# EAGLE design HDR camera controller (EAGLE 9.6.2)
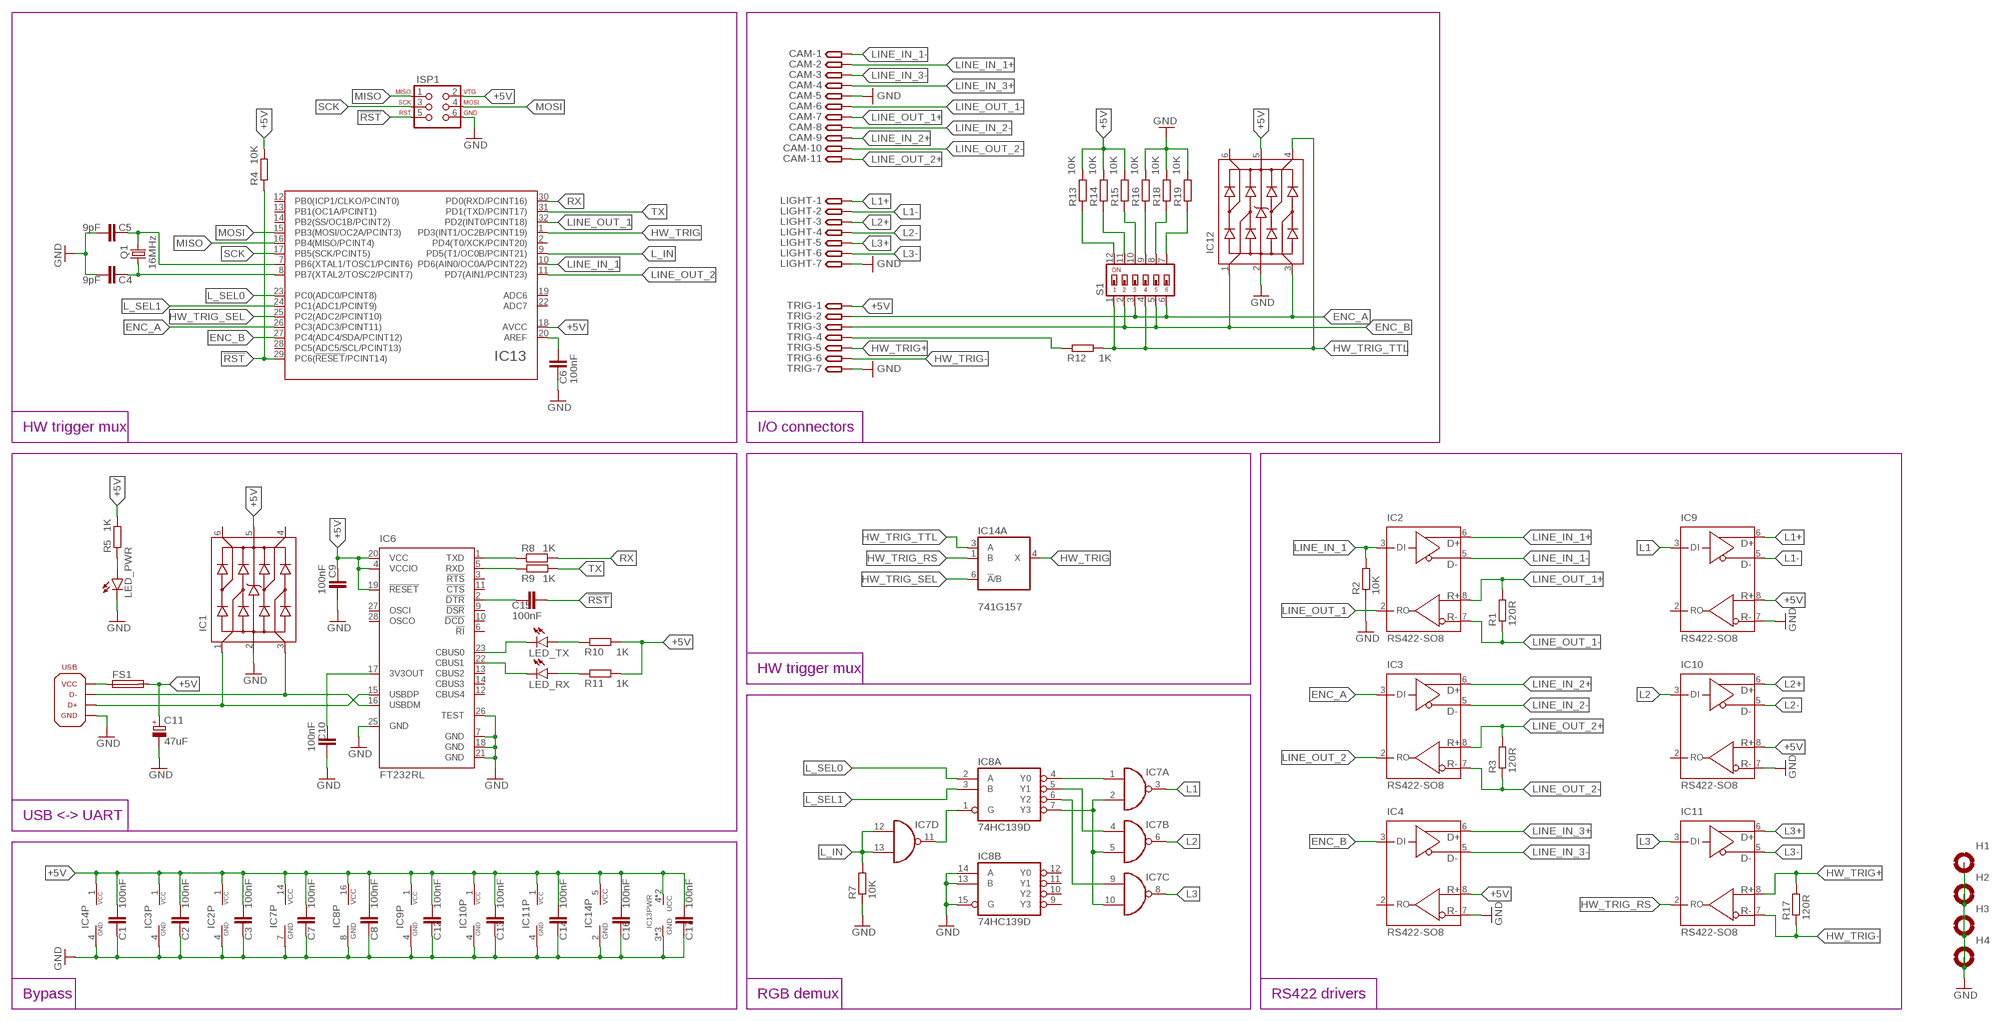
[diagram p0: schematic, sheet 1]

## Parts
C1  100nF  C-EUC0805  [C0805]
C2  100nF  C-EUC0805  [C0805]
C3  100nF  C-EUC0805  [C0805]
C4  9pF  C-EUC0805  [C0805]
C5  9pF  C-EUC0805  [C0805]
C6  100nF  C-EUC0805  [C0805]
C7  100nF  C-EUC0805  [C0805]
C8  100nF  C-EUC0805  [C0805]
C9  100nF  C-EUC0805  [C0805]
C10  100nF  C-EUC0805  [C0805]
C11  47uF  CPOL-EU153CLV-0605  [153CLV-0605]
C12  100nF  C-EUC0805  [C0805]
C13  100nF  C-EUC0805  [C0805]
C14  100nF  C-EUC0805  [C0805]
C15  100nF  C-EUC0805  [C0805]
C16  100nF  C-EUC0805  [C0805]
C17  100nF  C-EUC0805  [C0805]
CAM  SMPAD-11  [S-11P]
FS1  POLYFUSE_1210  [1210]
H1  HOLE-3MM_PLATED  [3MM_PLATED]
H2  HOLE-3MM_PLATED  [3MM_PLATED]
H3  HOLE-3MM_PLATED  [3MM_PLATED]
H4  HOLE-3MM_PLATED  [3MM_PLATED]
IC1  USBLC6-4  [SOT23-6]
IC2  RS422-SO8  [SO08]
IC3  RS422-SO8  [SO08]
IC4  RS422-SO8  [SO08]
IC6  FT232RL  [SSOP28]
IC7  74HC00D  [SO14]
IC8  74HC139D  [SO16]
IC9  RS422-SO8  [SO08]
IC10  RS422-SO8  [SO08]
IC11  RS422-SO8  [SO08]
IC12  USBLC6-4  [SOT23-6]
IC13  ATMEGA48/88/168/328-AU  [TQFP32-08]
IC14  741G157  [SOT457W_PHILIPS]
ISP1  ISP-SMD  [ISP_SMD]
LED_PWR  LEDSML0805  [SML0805]
LED_RX  LEDSML0805  [SML0805]
LED_TX  LEDSML0805  [SML0805]
LIGHT  SMPAD-7  [S-7P]
Q1  16MHz  RESONATOR_CRY  [CRYSTAL-3.2X2.5]
R1  120R  R-EU_R0805  [R0805]
R2  10K  R-EU_R0805  [R0805]
R3  120R  R-EU_R0805  [R0805]
R4  10K  R-EU_R0805  [R0805]
R5  1K  R-EU_R0805  [R0805]
R7  10K  R-EU_R0805  [R0805]
R8  1K  R-EU_R0805  [R0805]
R9  1K  R-EU_R0805  [R0805]
R10  1K  R-EU_R0805  [R0805]
R11  1K  R-EU_R0805  [R0805]
R12  1K  R-EU_R0805  [R0805]
R13  10K  R-EU_R0805  [R0805]
R14  10K  R-EU_R0805  [R0805]
R15  10K  R-EU_R0805  [R0805]
R16  10K  R-EU_R0805  [R0805]
R17  120R  R-EU_R0805  [R0805]
R18  10K  R-EU_R0805  [R0805]
R19  10K  R-EU_R0805  [R0805]
S1  SWS006  [SMS-006]
TRIG  SMPAD-7  [S-7P]
USB  USB_AB-B_SMD  [USB_B_SMD]

## Nets
!RST: C15.1 IC13.29(PC6(!RESET!/PCINT14)) ISP1.5(RST) R4.1
+5V: C1.1 C2.1 C3.1 C7.1 C8.1 C9.2 C11.+ C12.1 C13.1 C14.1 C16.1 C17.1 FS1.2 IC1.5 IC2.1(VCC) IC3.1(VCC) IC4.1(VCC) IC4.8(R+) IC6.4(VCCIO) IC6.19(!RESET) IC6.20(VCC) IC7.14(P:VCC) IC8.16(P:VCC) IC9.1(VCC) IC9.8(R+) IC10.1(VCC) IC10.8(R+) IC11.1(VCC) IC12.5 IC13.4(UCC) IC13.6(UCC) IC13.18(AVCC) IC14.5(P:VCC) ISP1.2(VTG) R4.2 R5.2 R10.2 R11.2 R13.2 R14.2 R15.2 TRIG.1
ENC_A: IC3.3(DI) IC12.3 IC13.26(PC3(ADC3/PCINT11)) S1.3 S1.6 TRIG.2
ENC_B: IC4.3(DI) IC12.1 IC13.27(PC4(ADC4/SDA/PCINT12)) S1.2 S1.5 TRIG.3
GND: C1.2 C2.2 C3.2 C4.1 C5.1 C6.2 C7.2 C8.2 C9.1 C10.1 C11.- C12.2 C13.2 C14.2 C16.2 C17.2 CAM.5 H1.1(MOUNT) H2.1(MOUNT) H3.1(MOUNT) H4.1(MOUNT) IC1.2 IC2.4(GND) IC3.4(GND) IC4.4(GND) IC4.7(R-) IC6.7(GND) IC6.18(GND) IC6.21(GND) IC6.25(GND) IC6.26(TEST) IC7.7(P:GND) IC8.8(P:GND) IC8.13(B:B) IC8.14(B:A) IC8.15(B:G) IC9.4(GND) IC9.7(R-) IC10.4(GND) IC10.7(R-) IC11.4(GND) IC12.2 IC13.3(GND) IC13.5(GND) IC13.21(GND) IC14.2(P:GND) ISP1.6(GND) LED_PWR.C LIGHT.7 R2.1 R7.1 R16.2 R18.2 R19.2 TRIG.7 USB.4(GND) USB.G1(GND) USB.G2(GND)
HW_TRIG: IC13.1(PD3(INT1/OC2B/PCINT19)) IC14.4(A:X)
HW_TRIG+: IC11.8(R+) R17.2 TRIG.5
HW_TRIG-: IC11.7(R-) R17.1 TRIG.6
HW_TRIG_RS: IC11.2(RO) IC14.1(A:B)
HW_TRIG_SEL: IC13.25(PC2(ADC2/PCINT10)) IC14.6(A:!A!/B)
HW_TRIG_TTL: IC12.4 IC14.3(A:A) R12.2 S1.1 S1.4
L1: IC7.3(A:O) IC9.3(DI)
L1+: IC9.6(D+) LIGHT.1
L1-: IC9.5(D-) LIGHT.2
L2: IC7.6(B:O) IC10.3(DI)
L2+: IC10.6(D+) LIGHT.3
L2-: IC10.5(D-) LIGHT.4
L3: IC7.8(C:O) IC11.3(DI)
L3+: IC11.6(D+) LIGHT.5
L3-: IC11.5(D-) LIGHT.6
L_IN: IC7.12(D:I0) IC7.13(D:I1) IC13.9(PD5(T1/OC0B/PCINT21)) R7.2
L_SEL0: IC8.2(A:A) IC13.23(PC0(ADC0/PCINT8))
L_SEL1: IC8.3(A:B) IC13.24(PC1(ADC1/PCINT9))
LINE_IN_1: IC2.3(DI) IC13.10(PD6(AIN0/OC0A/PCINT22)) R2.2
LINE_IN_1+: CAM.2 IC2.6(D+)
LINE_IN_1-: CAM.1 IC2.5(D-)
LINE_IN_2+: CAM.9 IC3.6(D+)
LINE_IN_2-: CAM.8 IC3.5(D-)
LINE_IN_3+: CAM.4 IC4.6(D+)
LINE_IN_3-: CAM.3 IC4.5(D-)
LINE_OUT_1: IC2.2(RO) IC13.32(PD2(INT0/PCINT18))
LINE_OUT_1+: CAM.7 IC2.8(R+) R1.2
LINE_OUT_1-: CAM.6 IC2.7(R-) R1.1
LINE_OUT_2: IC3.2(RO) IC13.11(PD7(AIN1/PCINT23))
LINE_OUT_2+: CAM.11 IC3.8(R+) R3.2
LINE_OUT_2-: CAM.10 IC3.7(R-) R3.1
MISO: IC13.16(PB4(MISO/PCINT4)) ISP1.1(MISO)
MOSI: IC13.15(PB3(MOSI/OC2A/PCINT3)) ISP1.4(MOSI)
N$1: C5.2 IC13.7(PB6(XTAL1/TOSC1/PCINT6)) Q1.3
N$2: C4.2 IC13.8(PB7(XTAL2/TOSC2/PCINT7)) Q1.1
N$3: IC1.1 IC6.15(USBDP) USB.3(D+)
N$4: IC1.3 IC6.16(USBDM) USB.2(D-)
N$5: IC7.11(D:O) IC8.1(A:G)
N$6: IC7.1(A:I0) IC8.4(A:Y0)
N$7: IC7.4(B:I0) IC8.5(A:Y1)
N$8: IC7.9(C:I0) IC8.6(A:Y2)
N$9: IC7.2(A:I1) IC7.5(B:I1) IC7.10(C:I1) IC8.7(A:Y3)
N$10: R12.1 TRIG.4
N$11: R16.1 S1.9
N$12: R18.1 S1.8
N$13: FS1.1 USB.1(VCC)
N$14: C10.2 IC6.17(3V3OUT)
N$15: IC6.1(TXD) R8.1
N$16: IC6.5(RXD) R9.1
N$17: C15.2 IC6.2(!DTR)
N$18: IC6.22(CBUS1) LED_RX.C
N$19: IC6.23(CBUS0) LED_TX.C
N$20: LED_TX.A R10.1
N$21: LED_RX.A R11.1
N$22: R19.1 S1.7
N$23: R15.1 S1.10
N$24: R14.1 S1.11
N$25: R13.1 S1.12
N$26: LED_PWR.A R5.1
N$27: C6.1 IC13.20(AREF)
RX: IC13.30(PD0(RXD/PCINT16)) R8.2
SCK: IC13.17(PB5(SCK/PCINT5)) ISP1.3(SCK)
TX: IC13.31(PD1(TXD/PCINT17)) R9.2
Unconnected: IC1.4 IC1.6 IC4.2(RO) IC6.3(!RTS) IC6.6(!RI) IC6.9(!DSR) IC6.10(!DCD) IC6.11(!CTS) IC6.12(CBUS4) IC6.13(CBUS2) IC6.14(CBUS3) IC6.27(OSCI) IC6.28(OSCO) IC8.9(B:Y3) IC8.10(B:Y2) IC8.11(B:Y1) IC8.12(B:Y0) IC9.2(RO) IC10.2(RO) IC12.6 IC13.2(PD4(T0/XCK/PCINT20)) IC13.12(PB0(ICP1/CLKO/PCINT0)) IC13.13(PB1(OC1A/PCINT1)) IC13.14(PB2(SS/OC1B/PCINT2)) IC13.19(ADC6) IC13.22(ADC7) IC13.28(PC5(ADC5/SCL/PCINT13))

## Notes on the sheet
- HW trigger mux | I/O connectors
- HW trigger mux
- USB <-> UART
- Bypass | RGB demux | RS422 drivers

## Library data of the parts
C1-C10 C12-C17 = rcl:C-EU: CAPACITOR, European symbol; SPICEPREFIX: C
C11 = rcl:CPOL-EU: POLARIZED CAPACITOR, European symbol; MPN: SC1E476M6L005VR; SPICEPREFIX: C
CAM = custom connectors:SMPAD-11
FS1 = custom general:POLYFUSE; MPN: SM010-60
H1-H4 = custom mounting:HOLE
IC1 IC12 = custom ICs:USBLC6-4: SHOTTKY DIODE; MPN: USBLC6
IC2-IC4 IC9-IC11 = custom ICs:RS422: RS485 TRANSEIVER Source: Data sheet <http://datasheets.maxim-ic.com/en/ds/MAX1487-MAX491.pdf>; MF: MAXIM; MPN: DS8921AMX/NOPB; OC_FARNELL: 3534170; OC_NEWARK: 34C3921
IC6 = ftdichip:FT232R: Source: http://www.ftdichip.com/Documents/DataSheets/DS_FT232R_v104.pdf; MPN: FT232RL; OC_FARNELL: 1146032; OC_NEWARK: 91K9918
IC7 = 74xx-eu:74*00: Quad 2-input NAND gate; MPN: SN74HC00DR
IC8 = 74xx-eu:74*139: Dual 2-line to 4-line DECODER/DEMULTIPLEXER; MPN: SN74HC139DR
IC13 = atmel_tiny24-44-84tiny48-88mega48-88-168-328:ATMEGA48/88/168/328
IC14 = custom ICs:74*1G157; MPN: 74LVC1G157GV.125
ISP1 = custom connectors:ISP: PIN HEADER
LED_PWR LED_RX LED_TX = led:LED: LED OSRAM: - CHIPLED LG R971, LG N971, LY N971, LG Q971, LY Q971, LO R971, LY R971 LH N974, LH R974 LS Q976, LO Q976, LY Q976 LO Q996 - Hyper CHIPLED LW Q18S LB Q993, LB Q99A, LB R99A - SideLED LS A670, LO A670, LY A670, LG A670, LP A670 LB A673, LV A673, LT A673, LW A673 LH A674 LY A675 LS A676, LA A676, LO A676, LY A676, LW A676 LS A679, LY A679, LG A679 - Hyper Micro SIDELED® LS Y876, LA Y876, LO Y876, LY Y876 LT Y87S - SmartLED LW L88C, LW L88S LB L89C, LB L89S, LG L890 LS L89K, LO L89K, LY L89K LS L896, LA L896, LO L896, LY L896 - TOPLED LS T670, LO T670, LY T670, LG T670, LP T670 LSG T670, LSP T670, LSY T670, LOP T670, LYG T670 LG T671, LOG T671, LSG T671 LB T673, LV T673, LT T673, LW T673 LH T674 LS T676, LA T676, LO T676, LY T676, LB T676, LH T676, LSB T676, LW T676 LB T67C, LV T67C, LT T67C, LS T67K, LO T67K, LY T67K, LW E67C LS E67B, LA E67B, LO E67B, LY E67B, LB E67C, LV E67C, LT E67C LW T67C LS T679, LY T679, LG T679 LS T770, LO T770, LY T770, LG T770, LP T770 LB T773, LV T773, LT T773, LW T773 LH T774 LS E675, LA E675, LY E675, LS T675 LS T776, LA T776, LO T776, LY T776, LB T776 LHGB T686 LT T68C, LB T68C - Hyper Mini TOPLED® LB M676 - Mini TOPLED Santana® LG M470 LS M47K, LO M47K, LY M47K Source: http://www.osram.convergy.de LUXEON: - LUMILED® LXK2-PW12-R00, LXK2-PW12-S00, LXK2-PW14-U00, LXK2-PW14-V00 LXK2-PM12-R00, LXK2-PM12-S00, LXK2-PM14-U00 LXK2-PE12-Q00, LXK2-PE12-R00, LXK2-PE12-S00, LXK2-PE14-T00, LXK2-PE14-U00 LXK2-PB12-K00, LXK2-PB12-L00, LXK2-PB12-M00, LXK2-PB14-N00, LXK2-PB14-P00, LXK2-PB14-Q00 LXK2-PR12-L00, LXK2-PR12-M00, LXK2-PR14-Q00, LXK2-PR14-R00 LXK2-PD12-Q00, LXK2-PD12-R00, LXK2-PD12-S00 LXK2-PH12-R00, LXK2-PH12-S00 LXK2-PL12-P00, LXK2-PL12-Q00, LXK2-PL12-R00 Source: www.luxeon.com KINGBRIGHT: KA-3528ASYC Source: www.kingbright.com
LIGHT TRIG = custom connectors:SMPAD-7
Q1 = custom passives:RESONATOR_CRY; MPN: 3225-16M-SR
R1-R5 R7-R19 = rcl:R-EU_: RESISTOR, European symbol; SPICEPREFIX: R
S1 = smd-special:SWS006: SMD Dip Switch 6 pol.; MPN: A6S-6102-H
USB = custom connectors:USB_AB; MPN: USBB-G-SMD

## Board
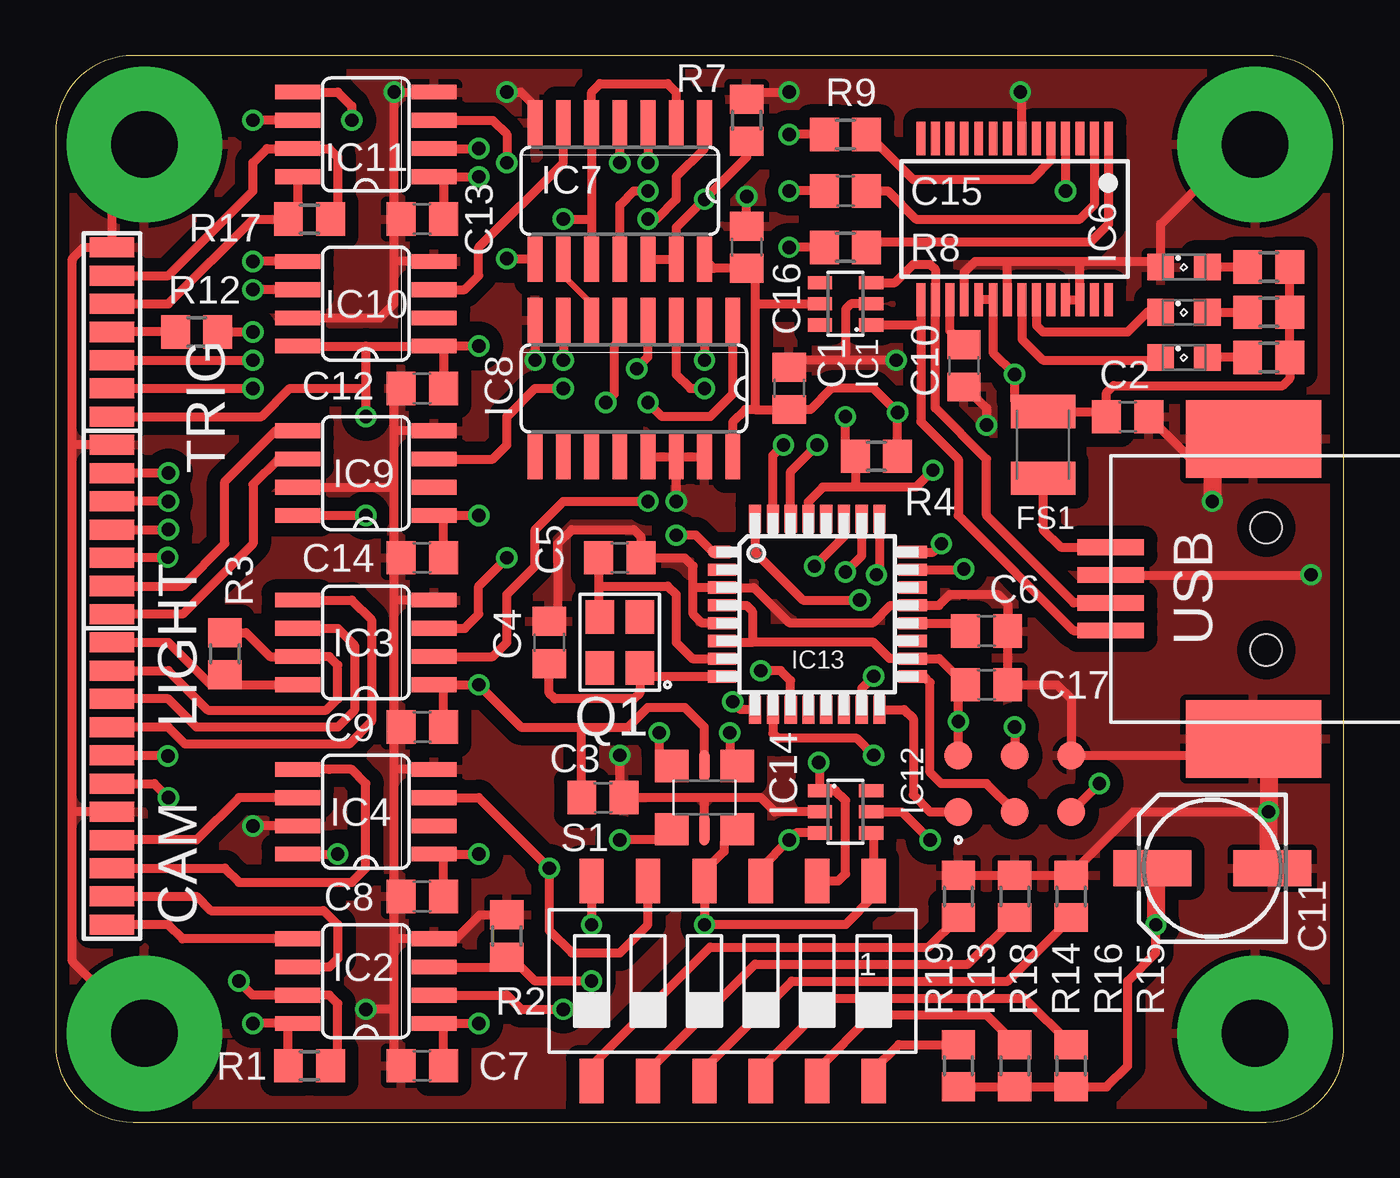
[diagram p1: board, top side]
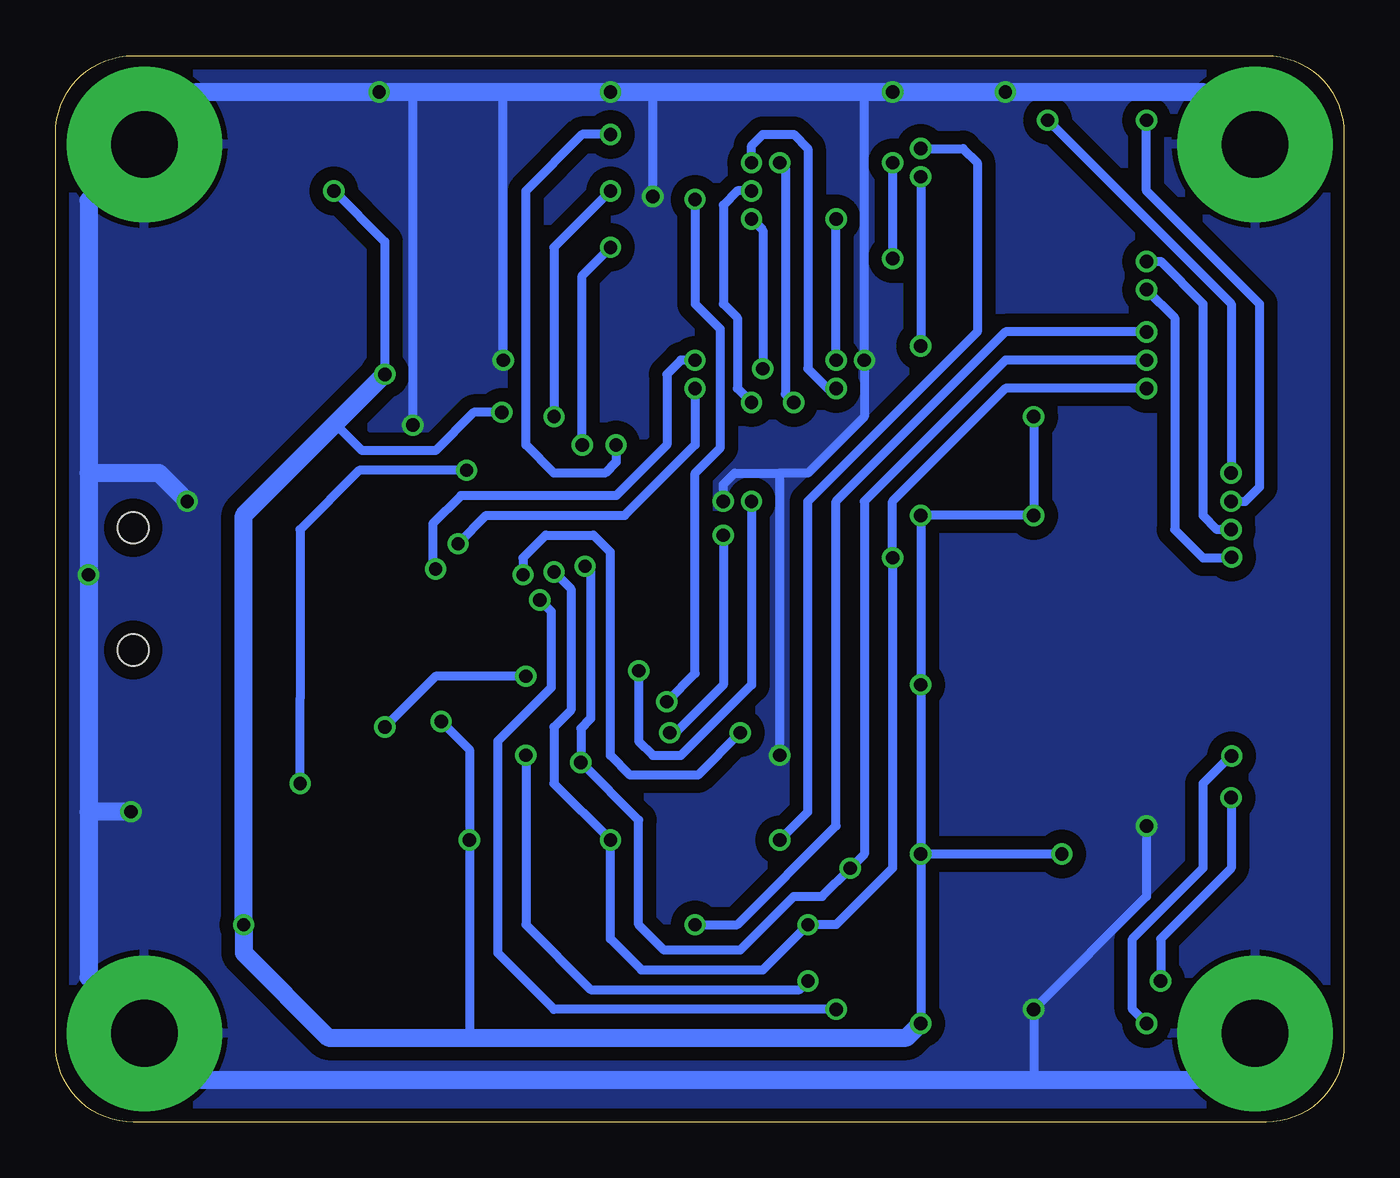
[diagram p2: board, bottom side, seen from below]

Size 58 x 48 mm. Coordinates in mm from the lower left corner, seen from the top.
Outline: 0,44.5 0,3.5 arc90 3.5,0 54.5,0 arc90 58,3.5 58,44.5 arc90 54.5,48 3.5,48 arc90 0,44.5
Copper layers (1*16): Top 0.035mm / dielectric 1.5mm / Bottom 0.035mm
Design rules "JLCPCB": minimum track width 8mil, minimum drill 0.3mm, track to track 8mil, track to pad 8mil, pad to pad 8mil, via to via 10mil, smd to smd 6mil, copper to edge 16mil, drill to drill 22mil, minimum pad ring 10mil, minimum via ring 7mil, stop-mask expansion 4mil, vias tented up to drill 1000mil, thermal gap 10mil

### Footprints (pad centres in the part's own frame; a part is rotated, then mirrored left to right if it is on the bottom)
C0805 = smd 1.3 x 1.5: 1 -0.95,0; 2 0.95,0
153CLV-0605 = smd 3.5 x 1.6: + 2.7,0; - -2.7,0
S-11P = smd 0.9 x 2: 1 -6.35,0; 2 -5.08,0; 3 -3.81,0; 4 -2.54,0; 5 -1.27,0; 6 0,0; 7 1.27,0; 8 2.54,0; 9 3.81,0; 10 5.08,0; 11 6.35,0
1210 = smd 1.5 x 2.9: 1 -1.5,0; 2 1.5,0
3MM_PLATED = drill 3 pad 7: 1 0,0
SOT23-6 = smd 0.6 x 1.1: 1 -0.95,-1.15; 2 0,-1.15; 3 0.95,-1.15; 4 0.95,1.15; 5 0,1.15; 6 -0.95,1.15
SO08 = smd 0.66 x 2.032: 1 -1.905,-3.073; 2 -0.635,-3.073; 3 0.635,-3.073; 4 1.905,-3.073; 5 1.905,3.073; 6 0.635,3.073; 7 -0.635,3.073; 8 -1.905,3.073
SSOP28 = smd 0.4 x 1.5: 1 -4.225,-3.625; 2 -3.575,-3.625; 3 -2.925,-3.625; 4 -2.275,-3.625; 5 -1.625,-3.625; 6 -0.975,-3.625; 7 -0.325,-3.625; 8 0.325,-3.625; 9 0.975,-3.625; 10 1.625,-3.625; 11 2.275,-3.625; 12 2.925,-3.625; 13 3.575,-3.625; 14 4.225,-3.625; 15 4.225,3.625; 16 3.575,3.625; 17 2.925,3.625; 18 2.275,3.625; 19 1.625,3.625; 20 0.975,3.625; 21 0.325,3.625; 22 -0.325,3.625; 23 -0.975,3.625; 24 -1.625,3.625; 25 -2.275,3.625; 26 -2.925,3.625; 27 -3.575,3.625; 28 -4.225,3.625
SO14 = smd 0.66 x 2.032: 1 -3.81,-3.073; 2 -2.54,-3.073; 3 -1.27,-3.073; 4 0,-3.073; 5 1.27,-3.073; 6 2.54,-3.073; 7 3.81,-3.073; 8 3.81,3.073; 9 2.54,3.073; 10 1.27,3.073; 11 0,3.073; 12 -1.27,3.073; 13 -2.54,3.073; 14 -3.81,3.073
SO16 = smd 0.66 x 2.032: 1 -4.445,-3.073; 2 -3.175,-3.073; 3 -1.905,-3.073; 4 -0.635,-3.073; 5 0.635,-3.073; 6 1.905,-3.073; 7 3.175,-3.073; 8 4.445,-3.073; 9 4.445,3.073; 10 3.175,3.073; 11 1.905,3.073; 12 0.635,3.073; 13 -0.635,3.073; 14 -1.905,3.073; 15 -3.175,3.073; 16 -4.445,3.073
TQFP32-08 = smd 1.27 x 0.55: 1 -4.293,2.8; 2 -4.293,2; 3 -4.293,1.2; 4 -4.293,0.4; 5 -4.293,-0.4; 6 -4.293,-1.2; 7 -4.293,-2; 8 -4.293,-2.8; 17 4.293,-2.8; 18 4.293,-2; 19 4.293,-1.2; 20 4.293,-0.4; 21 4.293,0.4; 22 4.293,1.2; 23 4.293,2; 24 4.293,2.8 | smd 0.55 x 1.27: 9 -2.8,-4.293; 10 -2,-4.293; 11 -1.2,-4.293; 12 -0.4,-4.293; 13 0.4,-4.293; 14 1.2,-4.293; 15 2,-4.293; 16 2.8,-4.293; 25 2.8,4.293; 26 2,4.293; 27 1.2,4.293; 28 0.4,4.293; 29 -0.4,4.293; 30 -1.2,4.293; 31 -2,4.293; 32 -2.8,4.293
SOT457W_PHILIPS = smd 1.5 x 1.45: 1 -1.475,-1.425; 3 1.475,-1.425; 4 1.475,1.425; 6 -1.475,1.425 | smd 0.45 x 1.45: 2 0,-1.425; 5 0,1.425
ISP_SMD = smd 1.27 x 1.27: 1 -1.27,2.54; 2 1.27,2.54; 3 -1.27,0; 4 1.27,0; 5 -1.27,-2.54; 6 1.27,-2.54
SML0805 = smd 1.2 x 1.2: A 1.05,0; C -1.05,0
S-7P = smd 0.9 x 2: 1 -3.81,0; 2 -2.54,0; 3 -1.27,0; 4 0,0; 5 1.27,0; 6 2.54,0; 7 3.81,0
CRYSTAL-3.2X2.5 = smd 1.5 x 1.3: 1 -1.15,-0.9; 2 1.15,-0.9; 3 1.15,0.9; 4 -1.15,0.9
R0805 = smd 1.3 x 1.5: 1 -0.95,0; 2 0.95,0
SMS-006 = smd 1.092 x 2.007: 1 -6.35,-4.496; 2 -3.81,-4.496; 3 -1.27,-4.496; 4 1.27,-4.496; 5 3.81,-4.496; 6 6.35,-4.496; 7 6.35,4.496; 8 3.81,4.496; 9 1.27,4.496; 10 -1.27,4.496; 11 -3.81,4.496; 12 -6.35,4.496
USB_B_SMD = smd 0.7 x 3: 1 1.875,16; 2 -0.625,16; 3 -1.875,16; 4 0.625,16 | smd 3.5 x 6.1: G1 -6.75,9.58; G2 6.75,9.58 | hole 1.4: -2.75,9; 2.75,9

### Placement (x,y rotation side)
C1  33.02,33.02 90 top
C2  48.26,31.75 0 top
C3  24.64,14.61 0 top
C4  22.23,21.59 270 top
C5  25.4,25.4 180 top
C6  41.91,22.1 0 top
C7  16.51,2.54 180 top
C8  16.51,10.16 180 top
C9  16.51,17.78 0 top
C10  40.89,34.04 90 top
C11  52.07,11.43 180 top
C12  16.51,33.02 180 top
C13  16.51,40.64 180 top
C14  16.51,25.4 180 top
C15  35.56,41.91 0 top
C16  31.11,39.37 90 top
C17  41.91,19.68 0 top
CAM  2.54,15.24 90 top
FS1  44.45,30.48 90 top
H1  4,4 0 top
H2  4,44 0 top
H3  54,44 0 top
H4  54,4 0 top
IC1  35.56,36.83 90 top
IC2  13.97,6.35 90 top
IC3  13.97,21.59 90 top
IC4  13.97,13.97 90 top
IC6  43.18,40.64 180 top
IC7  25.4,41.91 180 top
IC8  26.04,33.02 180 top
IC9  13.97,29.21 90 top
IC10  13.97,36.83 90 top
IC11  13.97,44.45 90 top
IC12  35.56,13.97 270 top
IC13  34.29,22.86 0 top
IC14  29.21,14.61 0 top
ISP1  43.18,15.24 90 top
LED_PWR  50.8,38.48 0 top
LED_RX  50.8,34.42 0 top
LED_TX  50.8,36.45 0 top
LIGHT  2.54,26.67 90 top
Q1  25.4,21.59 90 top
R1  11.43,2.54 180 top
R2  20.32,8.38 270 top
R3  7.62,21.08 270 top
R4  36.96,29.97 0 top
R5  54.61,38.48 0 top
R7  31.11,45.09 270 top
R8  35.56,39.37 180 top
R9  35.56,44.45 180 top
R10  54.61,36.45 0 top
R11  54.61,34.42 0 top
R12  6.35,35.56 0 top
R13  40.64,2.54 270 top
R14  43.18,2.54 270 top
R15  45.72,2.54 270 top
R16  45.72,10.16 90 top
R17  11.43,40.64 180 top
R18  43.18,10.16 90 top
R19  40.64,10.16 90 top
S1  30.48,6.35 180 top
TRIG  2.54,35.56 90 top
USB  63.5,24 90 top

### Tracks (layer width: path | path; a pad name or v marks a point on that pad's centre or on a via)
!RST  (via drill 0.6)
  Top 0.406: C15.1 v33.02,41.91 | v35.56,31.75 35.56,30.42 R4.1 36.01,28.64 36.07,28.57 | IC13.29 33.89,27.92 34.54,28.57 36.07,28.57 | ISP1.5 v46.99,15.24 | v39.5,29.34 38.73,28.57 36.07,28.57
  Bottom 0.406: v33.02,41.91 35.56,39.37 v35.56,31.75 | v39.5,29.34 44.32,29.34 46.99,26.67 46.99,19.05 v46.99,15.24
+5V  (via drill 0.6)
  Top 0.406: 17.46,34.92 IC10.1 13.97,34.92 | 17.46,34.92 C12.1 | C13.1 17.46,42.55 IC11.1 v19.05,42.55 | C14.1 17.46,27.3 IC9.1 v19.05,27.3 | C9.2 17.46,19.68 IC3.1 v19.05,19.68 20.95,17.78 23.75,17.78 | C8.1 17.46,12.06 IC4.1 v19.05,12.06 | C7.1 17.46,4.45 IC2.1 v19.05,4.45 | IC9.8 v13.97,27.3 | IC4.8 v12.7,12.06 | R5.2 R10.2 R11.2 55.56,33.46 55.24,33.15 47.62,33.15 47.31,32.83 C2.1 47.08,31.98 FS1.2 43.69,31.98 43.18,32.49 v43.18,33.66 42.2,34.63 IC6.20 IC6.19 | IC6.4 45.45,41.92 v45.47,41.91 | R13.2 R14.2 R15.2 47.31,1.59 48.26,2.54 48.26,6.35 49.53,7.62 v49.53,8.89 | IC7.14 29.63,38.42 C16.1 31.5,38.04 31.5,36.83 | IC8.16 30.48,31.5 31.05,32.07 31.5,32.07 | 31.5,32.07 C1.1 33.98,32.07 34.92,33.02 36.83,33.02 v37.91,31.94 R4.2 | 31.5,36.83 31.5,32.07 | v19.05,34.92 17.46,34.92 | IC10.8 13.97,34.92 | 13.97,34.92 13.97,33.02 | 13.97,33.02 v13.97,31.75 | IC13.6 30.07,21.59 31.37,21.59 | ISP1.2 v40.64,18.03 40.64,19.36 C17.1 39.78,20.86 IC13.18 37.56,20.86 36.83,21.59 31.37,21.59 | IC14.5 29.21,17.78 28.32,18.67 26.67,18.67 25.78,17.78 23.75,17.78 | IC12.5 38.1,13.97 v39.37,12.7 | C3.1 23.69,17.72 23.75,17.78 | 13.97,33.02 10.54,33.02 9.27,31.75 TRIG.1 | IC13.4 31.1,23.26 31.37,22.99 31.37,21.59 | 31.5,36.83 IC1.5
  Top 0.813: C11.+ 49.53,11.27 v49.53,8.89
  Bottom 0.406: v19.05,12.06 v19.05,19.68 v19.05,27.3 v13.97,27.3 v13.97,31.75 | v19.05,12.06 v19.05,4.45 | v12.7,12.06 v19.05,12.06 | v45.47,41.91 43.18,39.62 v43.18,33.66 | v19.05,42.55 v19.05,34.92 | 39.37,3.81 v39.37,12.7 39.37,16.76 v40.64,18.03 | v37.91,31.94 39.18,31.94 40.89,30.23 44.2,30.23 45.4,31.43
  Bottom 0.813: v19.05,4.45 19.68,3.81 39.37,3.81 45.72,3.81 49.53,7.62 v49.53,8.89 49.53,27.3 45.4,31.43 v43.18,33.66
ENC_A  (via drill 0.6)
  Top 0.406: TRIG.2 v8.89,33.02 | S1.3 31.75,11.43 v33.02,12.7 33.34,13.02 IC12.3 | S1.6 v24.13,8.89 | v35.56,24.77 36.29,25.5 IC13.26 | IC3.3 18.41,22.23 19.05,22.86 19.05,24.13 v20.32,25.4
  Bottom 0.406: v8.89,33.02 15.24,33.02 20.32,27.94 v20.32,25.4 20.32,11.43 22.86,8.89 v24.13,8.89 26.16,6.86 31.62,6.86 33.02,8.26 v33.02,12.7 35.56,15.24 35.56,17.78 34.8,18.54 34.8,24 v35.56,24.77
ENC_B  (via drill 0.6)
  Top 0.406: TRIG.3 v8.89,34.29 | IC4.3 19.05,14.61 v22.23,11.43 22.23,8.64 23.24,7.62 25.4,7.62 26.67,8.89 S1.5 | S1.2 35.23,10.85 35.56,11.18 35.56,14.48 35.12,14.92 IC12.1 34.41,16.14 v34.35,16.19 | IC13.27 35.49,26.35 v34.16,25.02
  Bottom 0.406: v8.89,34.29 15.24,34.29 21.59,27.94 21.59,12.06 v22.23,11.43 23.5,10.16 24.77,10.16 27.18,7.75 30.61,7.75 31.75,8.89 31.75,13.59 v34.35,16.19 34.35,17.72 33.91,18.16 33.91,24.77 v34.16,25.02
GND  (via drill 0.6)
  Top 0.406: H2.1 2.54,42.54 TRIG.7 1.27,39.37 0.76,38.86 0.76,30.48 | H1.1 0.76,7.24 0.76,13.97 | 0.76,13.97 0.76,30.48 | LIGHT.7 0.76,30.48 | CAM.5 0.76,13.97 | C7.2 15.24,2.86 15.24,5.08 | 15.24,5.08 15.24,8.26 | 15.24,8.26 15.24,10.03 | 15.24,10.03 15.24,15.88 | 15.24,15.88 15.24,17.78 | 15.24,17.78 15.24,23.5 | 15.24,23.5 15.24,25.4 | 15.24,25.4 15.24,28.57 | 15.24,28.57 15.24,31.11 | 15.24,31.11 15.24,33.02 C12.2 | 15.24,38.73 15.24,36.83 14.61,36.2 IC10.7 | 15.24,38.73 15.24,40.64 | C13.2 15.24,40.64 | IC10.4 15.24,38.73 | IC9.4 15.24,31.11 | IC9.7 15.24,28.57 | C14.2 15.24,25.4 | IC3.4 15.24,23.5 | C9.1 15.24,17.78 | IC4.4 15.24,15.88 | C8.2 15.37,10.16 15.24,10.03 | 15.24,8.26 IC2.4 18.03,8.26 19.11,9.33 R2.1 | IC4.7 v8.89,13.34 | 15.24,5.08 v13.97,5.08 | IC6.18 40.91,38.24 41.4,38.73 42.8,38.73 | 42.8,38.73 46.1,38.73 | 46.1,38.73 IC6.26 IC6.25 | IC6.21 42.85,38.68 42.8,38.73 | C2.2 52.06,28.89 USB.G2 | 46.1,38.73 49.5,38.73 LED_PWR.C 49.75,40.41 53.34,44 H3.1 | IC6.7 43.51,46.28 v43.43,46.35 | v41.91,31.37 41.91,32.13 40.95,33.09 C10.1 | USB.4 56.5,24.62 v56.52,24.64 | IC1.2 35.81,36.83 35.56,36.58 35.56,34.29 | R19.2 R18.2 R16.2 45.72,11.18 48.51,13.97 v54.61,13.97 | C16.2 v31.11,41.66 | IC11.4 v15.24,46.35 15.24,40.64 | R7.1 31.43,46.35 v33.02,46.35 | v20.32,46.35 20.95,46.35 21.59,45.72 IC7.7 | IC8.13 IC8.14 | IC8.14 IC8.15 | v37.85,34.29 35.56,34.29 | 35.56,34.29 33.34,34.29 C1.2 | IC8.8 v21.59,34.29 | IC13.5 29.1,22.46 28.7,22.86 28.7,24 | 28.7,24 28.7,25.02 28.32,25.4 C5.1 26.35,26.36 26.04,26.67 23.24,26.67 22.61,26.04 22.61,22.92 C4.1 | 28.7,24 28.76,24.06 IC13.3 31.44,24.06 33.02,22.48 36.81,22.48 37.59,23.26 IC13.21 39.77,23.26 40.26,23.75 42.42,23.75 42.86,23.31 C6.2 C17.2 45.09,19.68 45.72,19.05 ISP1.6 53.18,16.51 USB.G1
  Top 0.406: IC12.2 32.38,13.97 31.75,14.61 29.21,14.61 | 29.21,14.61 C3.2 25.4,14.79 v25.4,16.51 | IC14.2 29.21,14.61 | IC8.14 v27.94,27.94
  Top 0.813: USB.G1 54.61,16.56 v54.61,13.97 54.61,11.59 C11.- | USB.G2 52.07,30.75 v52.07,27.94
  Bottom 0.406: 13.97,1.91 v13.97,5.08 8.89,10.16 v8.89,13.34 | v41.91,31.37 41.91,46.35 | v37.85,34.29 37.85,46.35 | v31.11,41.66 31.11,46.35 | 21.59,46.35 v21.59,34.29 21.59,31.75 24.13,29.21 25.4,29.21 | v25.4,16.51 25.4,29.21 | v27.94,27.94 27.94,28.7 27.43,29.21 25.4,29.21
  Bottom 0.813: H1.1 6.09,1.91 13.97,1.91 51.91,1.91 H4.1 56.52,6.51 56.52,13.97 | H2.1 6.36,46.35 v15.24,46.35 v20.32,46.35 21.59,46.35 31.11,46.35 v33.02,46.35 37.85,46.35 41.91,46.35 v43.43,46.35 51.65,46.35 H3.1 56.52,41.48 56.52,29.21 | 56.52,29.21 v56.52,24.64 56.52,13.97 | v54.61,13.97 56.52,13.97 | v52.07,27.94 53.34,29.21 56.52,29.21
  pour Top (isolate 0.61): -1.27,49.53 59.69,49.53 59.69,-1.27 -1.27,-1.27
  pour Bottom (isolate 0.61, rank 2): -2.54,50.8 60.96,50.8 60.96,-2.54 -2.54,-2.54
HW_TRIG  (via drill 0.6)
  Top 0.406: IC13.1 29.59,25.66 28.83,26.42 v27.94,26.42 | v30.35,17.53 30.35,16.36 IC14.4
  Bottom 0.406: v30.35,17.53 30.1,17.53 27.94,19.68 v27.94,26.42
HW_TRIG+
  Top 0.406: TRIG.5 5.08,36.83 8.89,40.64 R17.2 10.9,41.06 IC11.8
HW_TRIG-
  Top 0.406: TRIG.6 5.08,38.1 8.89,41.91 8.89,43.18 9.53,43.81 IC11.7 12.32,43.81 12.7,43.43 12.7,40.96 R17.1
HW_TRIG_RS  (via drill 0.6)
  Top 0.406: IC11.2 v19.05,43.81 | IC14.1 27.25,12.7 v25.4,12.7
  Bottom 0.406: v19.05,43.81 17.14,43.81 16.51,43.18 16.51,35.56 24.13,27.94 24.13,13.97 v25.4,12.7
HW_TRIG_SEL  (via drill 0.6)
  Top 0.406: IC14.6 27.18,16.59 v27.18,17.53 | IC13.25 37.09,24.77 37.08,24.77 v36.96,24.64
  Bottom 0.406: v36.96,24.64 36.96,25.4 35.94,26.42 33.78,26.42 33.02,25.65 33.02,16.51 32.13,15.62 29.08,15.62 v27.18,17.53
HW_TRIG_TTL  (via drill 0.6)
  Top 0.406: R12.2 v8.89,35.56 | IC12.4 36.83,12.9 S1.1 36.83,10.16 35.56,8.89 30.48,8.89 v29.21,8.89 S1.4 29.21,11.43 29.34,11.56 29.46,11.56 30.1,12.19 30.1,12.59 IC14.3
  Bottom 0.406: v8.89,35.56 15.24,35.56 22.86,27.94 22.86,13.34 27.3,8.89 v29.21,8.89
L1  (via drill 0.6)
  Top 0.406: IC9.3 19.68,29.84 20.32,30.48 20.32,31.75 21.59,33.02 v22.86,33.02 | IC7.3 v26.67,43.18
  Bottom 0.406: v26.67,43.18 26.67,43.94 26.16,44.45 24.77,44.45 24.13,43.81 24.13,33.91 23.24,33.02 v22.86,33.02
L1+
  Top 0.406: IC9.6 10.03,29.84 8.89,28.7 8.89,26.04 5.71,22.86 LIGHT.1
L1-
  Top 0.406: LIGHT.2 5.71,24.13 7.62,26.04 7.62,28.83 9.91,31.11 IC9.5
L2
  Top 0.406: IC10.3 18.41,37.47 19.05,38.1 19.05,39.37 22.86,43.18 IC7.6
L2+  (via drill 0.6)
  Top 0.406: IC10.6 v8.89,37.47 | v5.05,25.43 5.03,25.4 LIGHT.3
  Bottom 0.406: v8.89,37.47 7.62,36.2 7.62,26.67 6.35,25.4 5.08,25.4 v5.05,25.43
L2-  (via drill 0.6)
  Top 0.406: LIGHT.4 v5.08,26.67 | IC10.5 v8.89,38.73
  Bottom 0.406: v5.08,26.67 5.71,26.67 6.35,27.3 6.35,36.83 8.26,38.73 v8.89,38.73
L3  (via drill 0.6)
  Top 0.406: IC11.3 19.68,45.09 20.32,44.45 v20.32,43.18 | v20.32,38.86 21.57,38.86 IC7.8
  Bottom 0.406: v20.32,43.18 v20.32,38.86
L3+  (via drill 0.6)
  Top 0.406: IC11.6 v8.89,45.09 | v5.08,27.94 LIGHT.5
  Bottom 0.406: v8.89,45.09 8.89,41.91 3.81,36.83 3.81,28.57 4.45,27.94 v5.08,27.94
L3-  (via drill 0.6)
  Top 0.406: v5.08,29.21 LIGHT.6 | IC11.5 12.7,46.35 13.34,45.72 v13.34,45.09
  Bottom 0.406: v5.08,29.21 5.08,36.83 v13.34,45.09
L_IN  (via drill 0.6)
  Top 0.406: IC7.12 IC7.13 27.94,40.26 v29.21,41.53 31.11,43.43 R7.2 | IC13.9 30.84,18.57 v30.48,18.92
  Bottom 0.406: v29.21,41.53 29.21,36.83 28.07,35.69 28.07,30.35 29.21,29.21 29.21,20.19 v30.48,18.92
L_SEL0  (via drill 0.6)
  Top 0.406: IC8.2 v29.21,34.29 | IC13.23 40.86,24.86 v40.89,24.89
  Bottom 0.406: v29.21,34.29 29.84,34.29 30.48,33.66 30.48,30.48 32.77,28.19 39.75,28.19 41.02,26.92 41.02,25.02 v40.89,24.89
L_SEL1  (via drill 0.6)
  Top 0.406: IC8.3 27.94,33.66 28.57,33.02 v29.21,33.02 | IC13.24 39.5,25.66 v39.88,26.04
  Bottom 0.406: v29.21,33.02 29.21,30.48 32.38,27.3 38.61,27.3 v39.88,26.04
LINE_IN_1  (via drill 0.6)
  Top 0.406: IC2.3 20.32,6.99 | 20.32,6.99 20.95,6.99 21.59,6.35 v24.13,6.35 | R2.2 20.32,6.99 | IC13.10 32.29,17.49 32.51,17.27 36.07,17.27 v36.83,16.51
  Bottom 0.406: v36.83,16.51 36.83,8.89 33.91,5.97 24.51,5.97 v24.13,6.35
LINE_IN_1+
  Top 0.406: CAM.2 6.35,10.16 6.99,9.53 12.06,9.53 12.7,8.89 12.7,7.37 12.32,6.99 IC2.6
LINE_IN_1-
  Top 0.406: IC2.5 5.71,8.26 5.08,8.89 CAM.1
LINE_IN_2+
  Top 0.406: IC3.6 12.7,22.23 13.46,21.46 13.46,18.54 12.7,17.78 6.35,17.78 5.08,19.05 CAM.9
LINE_IN_2-
  Top 0.406: IC3.5 13.34,23.5 14.22,22.61 14.22,18.03 13.21,17.02 5.84,17.02 5.08,17.78 CAM.8
LINE_IN_3+
  Top 0.406: IC4.6 8.26,14.61 6.35,12.7 CAM.4
LINE_IN_3-
  Top 0.406: CAM.3 7.62,11.43 8.26,10.79 12.06,10.79 13.34,10.79 13.97,11.43 13.97,15.24 13.34,15.88 12.32,15.88 IC4.5
LINE_OUT_1  (via drill 0.6)
  Top 0.406: IC2.2 20.32,5.71 20.95,5.08 v22.86,5.08 | IC13.32 31.49,25.66 33.66,23.5 v36.2,23.5
  Bottom 0.406: v22.86,5.08 35.56,5.08 38.1,7.62 38.1,17.14 35.69,19.56 35.69,22.99 v36.2,23.5
LINE_OUT_1+  (via drill 0.6)
  Top 0.406: IC2.8 10.54,4.45 | 10.54,4.45 v8.89,4.45 | v5.05,16.48 2.57,16.48 CAM.7 | R1.2 10.48,4.38 10.54,4.45
  Bottom 0.406: v5.05,16.48 5.08,16.51 6.35,15.24 6.35,11.43 9.53,8.26 9.53,5.08 v8.89,4.45
LINE_OUT_1-  (via drill 0.6)
  Top 0.406: v8.26,6.35 8.26,6.33 8.87,5.71 IC2.7 12.32,5.71 12.7,5.33 12.7,2.86 R1.1 | v5.08,14.61 4.45,15.24 CAM.6
  Bottom 0.406: v5.08,14.61 5.08,11.43 8.26,8.26 v8.26,6.35
LINE_OUT_2  (via drill 0.6)
  Top 0.406: IC3.2 19.68,20.95 20.32,21.59 20.32,23.75 21.59,25.02 21.59,26.67 22.86,27.94 v26.67,27.94 | IC13.11 33.09,19.87 32.64,20.32 v31.75,20.32
  Bottom 0.406: v26.67,27.94 26.67,19.68 29.84,16.51 31.11,16.51 31.75,17.14 v31.75,20.32
LINE_OUT_2+
  Top 0.406: CAM.11 5.08,21.59 6.99,19.68 7.62,19.68 | 7.62,19.68 IC3.8 | R3.2 7.62,19.68
LINE_OUT_2-
  Top 0.406: CAM.10 5.08,20.32 6.86,18.54 12.19,18.54 12.7,19.05 12.7,20.57 12.32,20.95 IC3.7 9.65,20.95 8.57,22.03 R3.1
MISO
  Top 0.406: ISP1.1 39.37,13.97 38.61,14.73 38.61,18.16 38.2,18.57 IC13.16
MOSI  (via drill 0.6)
  Top 0.406: IC13.15 36.29,19.53 v36.83,20.07 | v43.18,17.78 ISP1.4
  Bottom 0.406: v36.83,20.07 40.89,20.07 v43.18,17.78
N$1
  Top 0.406: C5.2 24.45,24.13 | 24.45,24.13 24.45,22.79 Q1.3 | 24.45,24.13 27.56,24.13 27.94,23.75 27.94,21.59 28.67,20.86 IC13.7
N$2
  Top 0.406: IC13.8 26.68,20.06 Q1.1 26.3,19.32 26.04,19.05 22.48,19.05 22.23,19.3 C4.2
N$3
  Top 0.406: USB.3 45.82,22.12 40.64,27.3 40.64,29.84 38.95,31.53 38.95,35.81 | IC6.15 38.95,35.81 | IC1.1 38.89,35.88 38.95,35.81
N$4
  Top 0.406: USB.2 45.84,23.38 41.91,27.3 41.91,29.84 39.6,32.15 IC6.16 39.6,38.37 39.37,38.61 38.61,38.61 37.78,37.78 IC1.3
N$5  (via drill 0.6)
  Top 0.406: IC8.1 30.48,32.77 29.46,31.75 27.3,31.75 v26.67,32.38 | IC7.11 25.4,41.27 26.04,41.91 v26.67,41.91
  Bottom 0.406: v26.67,32.38 27.3,33.02 27.3,36.2 27.94,36.83 27.94,41.27 27.3,41.91 v26.67,41.91
N$6  (via drill 0.6)
  Top 0.406: IC7.1 29.21,43.81 27.94,42.55 27.94,41.53 27.05,40.64 v26.67,40.64 | v26.16,33.91 26.16,33.93 26.67,34.44 IC8.4
  Bottom 0.406: v26.67,40.64 26.16,40.13 v26.16,33.91
N$7  (via drill 0.6)
  Top 0.406: v25.4,43.18 IC7.4 | IC8.5 25.4,35.2 25.15,34.95 25.15,32.77 v24.77,32.38
  Bottom 0.406: v25.4,43.18 25.15,42.93 25.15,32.77 v24.77,32.38
N$8
  Top 0.254: IC7.9 22.86,38.1 24.13,36.83 IC8.6
N$9  (via drill 0.6)
  Top 0.406: 24.13,40.64 IC7.5 24.13,46.35 24.51,46.74 27.56,46.74 27.94,46.35 IC7.2 | 24.13,40.64 IC7.10 | IC8.7 v22.86,34.29 | v22.86,40.64 24.13,40.64
  Bottom 0.406: v22.86,34.29 v22.86,40.64
N$10
  Top 0.406: R12.1 TRIG.4
N$11
  Top 0.406: S1.9 29.21,2.41 33.15,6.35 42.86,6.35 R16.1
N$12
  Top 0.406: S1.8 26.67,2.29 31.5,7.11 41.08,7.11 R18.1
N$13
  Top 0.406: USB.1 45.24,25.88 44.45,26.67 FS1.1
N$14
  Top 0.406: C10.2 40.26,35.62 IC6.17
N$15
  Top 0.406: R8.1 36.83,39.37 37.08,39.62 46.61,39.62 47.41,40.42 IC6.1
N$16
  Top 0.406: IC6.5 44.8,43.28 43.94,42.42 38.61,42.42 36.58,44.45 R9.1
N$17
  Top 0.406: IC6.2 46.76,41.29 46.1,40.64 38.73,40.64 37.47,41.91 C15.2
N$18
  Top 0.406: LED_RX.C 49.62,34.29 44.45,34.29 43.51,35.23 IC6.22
N$19
  Top 0.406: LED_TX.C 49.15,36.45 48.26,35.56 44.45,35.56 44.16,35.85 IC6.23
N$20
  Top 0.406: LED_TX.A R10.1
N$21
  Top 0.406: R11.1 LED_RX.A
N$22
  Top 0.406: S1.7 24.13,2.54 29.46,7.87 39.3,7.87 R19.1
N$23
  Top 0.406: S1.10 31.75,2.41 34.92,5.59 43.62,5.59 R15.1
N$24
  Top 0.406: S1.11 34.29,2.36 36.75,4.83 41.91,4.83 43.18,3.56 R14.1
N$25
  Top 0.406: S1.12 36.83,2.36 37.96,3.49 R13.1
N$26
  Top 0.406: R5.1 LED_PWR.A
N$27
  Top 0.406: IC13.20 40.6,22.46 C6.1
RX  (via drill 0.6)
  Top 0.406: R8.2 v33.02,39.37 | IC13.30 33.09,29.28 v34.29,30.48
  Bottom 0.406: v33.02,39.37 34.29,38.1 v34.29,30.48
SCK
  Top 0.406: ISP1.3 41.91,15.24 39.88,15.24 39.37,15.75 39.37,19.78 39.09,20.06 IC13.17
TX  (via drill 0.6)
  Top 0.406: R9.2 v33.02,44.45 | IC13.31 32.29,30 v32.77,30.48
  Bottom 0.406: v33.02,44.45 34.29,44.45 36.83,41.91 36.83,30.48 35.56,29.21 33.27,29.21 32.77,29.72 v32.77,30.48

### Text on the board
bStop: HDR line cam / controller V1